# Altium project Mini_CS.PrjPcb
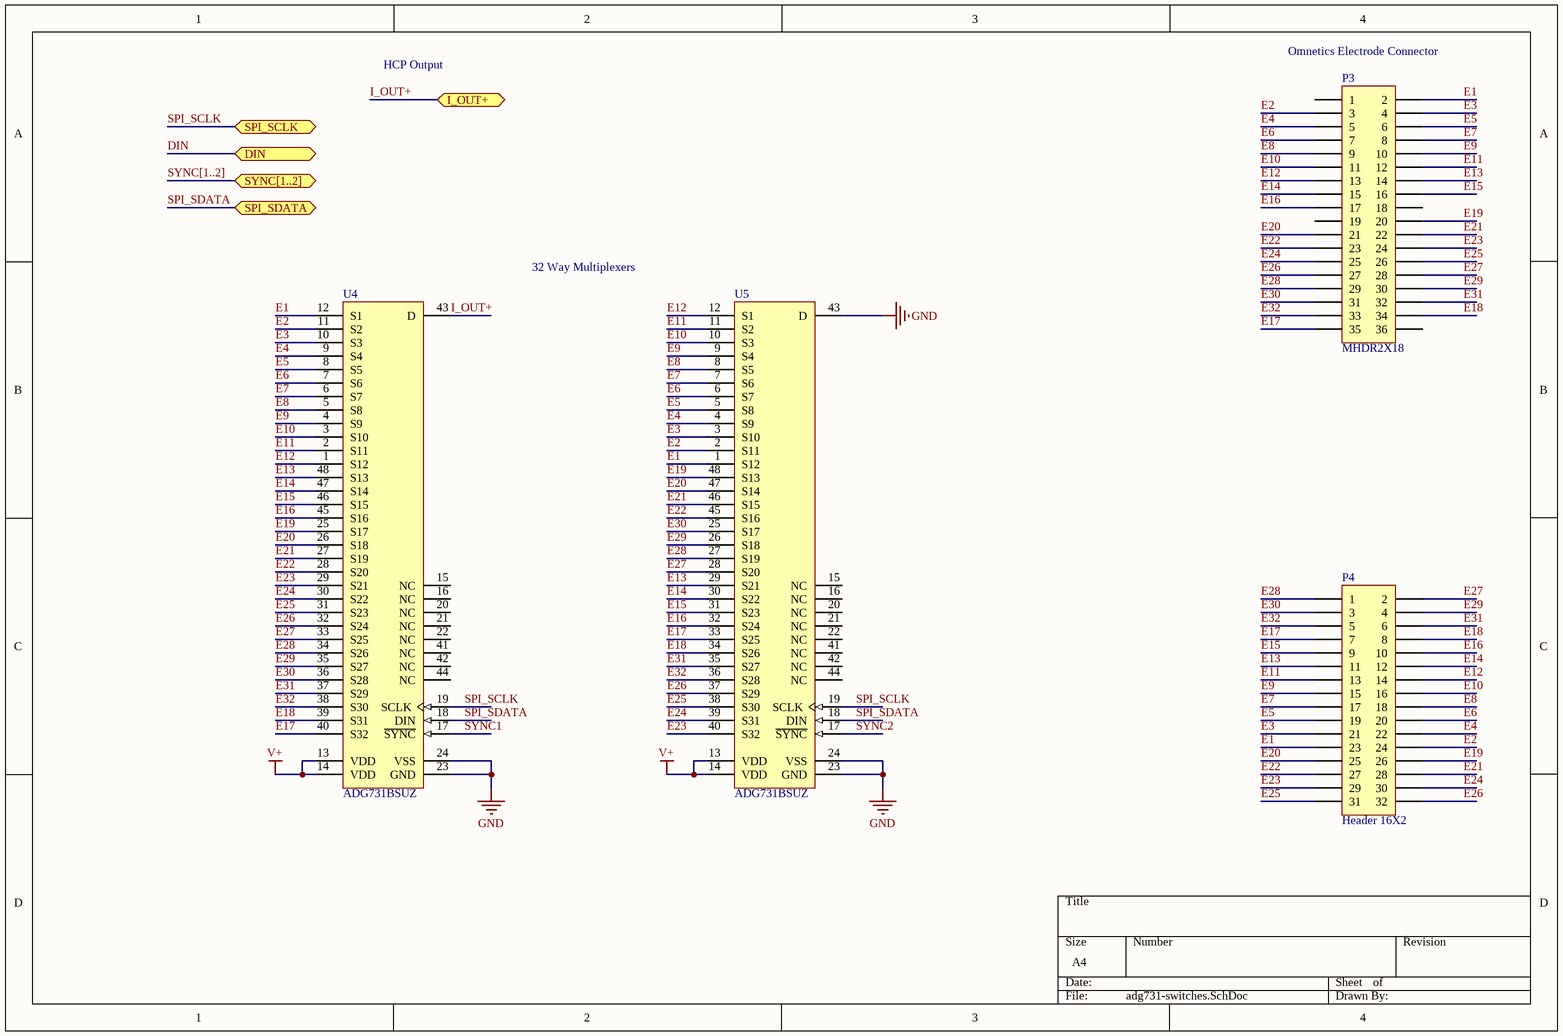
[diagram p0: adg731-switches.SchDoc]
3 sheets, 50 parts. Net scope: flat (ports and power ports of the same name join across sheets).
Board file: Mini_CS.PcbDoc
Sheets:
  adg731-switches.SchDoc
  AD9833_Single_Ended.SchDoc
  Power_Supply_and_Buttons.SchDoc

## Sheet adg731-switches.SchDoc
size A4

### Parts
P3  MHDR2X18  [A79025-001]
P4  Header 16X2  [FTSH-117-XX-XXX-DH]
U4  ADG731BSUZ  [ADI-SU-48_N]
U5  ADG731BSUZ  [ADI-SU-48_N]

### Ports
DIN (bidir), I_OUT+ (bidir), SPI_SCLK (bidir), SPI_SDATA (bidir), SYNC[1..2] (bidir)

### Nets
GND: U4.23(GND) U4.24(VSS) U5.23(GND) U5.24(VSS) U5.43(D)
V+: U4.13(VDD) U4.14(VDD) U5.13(VDD) U5.14(VDD)
DIN: port DIN
E1: P3.2 P4.23 U4.12(S1) U5.1(S12)
E2: P3.3 P4.24 U4.11(S2) U5.2(S11)
E3: P3.4 P4.21 U4.10(S3) U5.3(S10)
E4: P3.5 P4.22 U4.9(S4) U5.4(S9)
E5: P3.6 P4.19 U4.8(S5) U5.5(S8)
E6: P3.7 P4.20 U4.7(S6) U5.6(S7)
E7: P3.8 P4.17 U4.6(S7) U5.7(S6)
E8: P3.9 P4.18 U4.5(S8) U5.8(S5)
E9: P3.10 P4.15 U4.4(S9) U5.9(S4)
E10: P3.11 P4.16 U4.3(S10) U5.10(S3)
E11: P3.12 P4.13 U4.2(S11) U5.11(S2)
E12: P3.13 P4.14 U4.1(S12) U5.12(S1)
E13: P3.14 P4.11 U4.48(S13) U5.29(S21)
E14: P3.15 P4.12 U4.47(S14) U5.30(S22)
E15: P3.16 P4.9 U4.46(S15) U5.31(S23)
E16: P3.17 P4.10 U4.45(S16) U5.32(S24)
E17: P3.35 P4.7 U4.40(S32) U5.33(S25)
E18: P3.34 P4.8 U4.39(S31) U5.34(S26)
E19: P3.20 P4.26 U4.25(S17) U5.48(S13)
E20: P3.21 P4.25 U4.26(S18) U5.47(S14)
E21: P3.22 P4.28 U4.27(S19) U5.46(S15)
E22: P3.23 P4.27 U4.28(S20) U5.45(S16)
E23: P3.24 P4.29 U4.29(S21) U5.40(S32)
E24: P3.25 P4.30 U4.30(S22) U5.39(S31)
E25: P3.26 P4.31 U4.31(S23) U5.38(S30)
E26: P3.27 P4.32 U4.32(S24) U5.37(S29)
E27: P3.28 P4.2 U4.33(S25) U5.28(S20)
E28: P3.29 P4.1 U4.34(S26) U5.27(S19)
E29: P3.30 P4.4 U4.35(S27) U5.26(S18)
E30: P3.31 P4.3 U4.36(S28) U5.25(S17)
E31: P3.32 P4.6 U4.37(S29) U5.35(S27)
E32: P3.33 P4.5 U4.38(S30) U5.36(S28)
I_OUT+: U4.43(D) ; port I_OUT+
SPI_SCLK: U4.19(SCLK) U5.19(SCLK) ; port SPI_SCLK
SPI_SDATA: U4.18(DIN) U5.18(DIN) ; port SPI_SDATA
SYNC1: U4.17(~{SYNC})
SYNC2: U5.17(~{SYNC})

Not connected (* = marked no-connect by the designer): P3 1 18 19 36; U4 15(NC) 16(NC) 20(NC) 21(NC) 22(NC) 41(NC) 42(NC) 44(NC); U5 15(NC) 16(NC) 20(NC) 21(NC) 22(NC) 41(NC) 42(NC) 44(NC)

### Buses and harness runs
bus SYNC[1..2] = port SYNC[1..2]

### Notes on the sheet
- HCP Output
- (near P3) Omnetics Electrode Connector
- 32 Way Multiplexers

### Library data of the parts
P3 = MHDR2X18: Header, 18-Pin, Dual row; LatestRevisionDate: 17-Jul-2002; LatestRevisionNote: Re-released for DXP Platform.; Publisher: Altium Limited
P4 = Header 16X2: Header, 16-Pin, Dual row; LatestRevisionDate: 17-Jul-2002; LatestRevisionNote: Re-released for DXP Platform.; Publisher: Altium Limited
U4 U5 = CMP-0798-00240-1: 1.8 to 5.5 V / +/-2.5 V, 4 Ohm, Serially Controlled, 32-Channel Analog Multiplexer, -40 to 85 degC, 48-pin QFP (SU-48), Tray; Manufacturer: Analog Devices; Bandwidth (Hz): 18M; Max Analog Signal Range: Vss to Vdd; t transition (s): 42n; Ron (ohms): 4; Supply V Guar Performance: Dual_(+/-2.5V), Single_(+3V), Single_(+5V); ComponentLink2Description: Datasheet; Packing: Tray; Code_JEDEC: MS-026ABC; ComponentLink3URL: http://www.analog.com/static/imported-files/packages/470644706845302410119987SU48_7x7.pdf; PackageDescription: 48-Pin Thin Plastic Quad Flat Package, Body 7 x 7 mm, Pitch 0.5 mm; ComponentLink1Description: Manufacturer URL; DatasheetVersion: Rev. A; ComponentLink1URL: http://www.analog.com/en/index.html; Mounting Technology: Surface Mount; ComponentLink2URL: http://www.analog.com/static/imported-files/data_sheets/ADG725_731.pdf; PartNumber: ADG731BSUZ; PackageReference: SU-48; ComponentLink3Description: Package Specification

## Sheet AD9833_Single_Ended.SchDoc
size A4
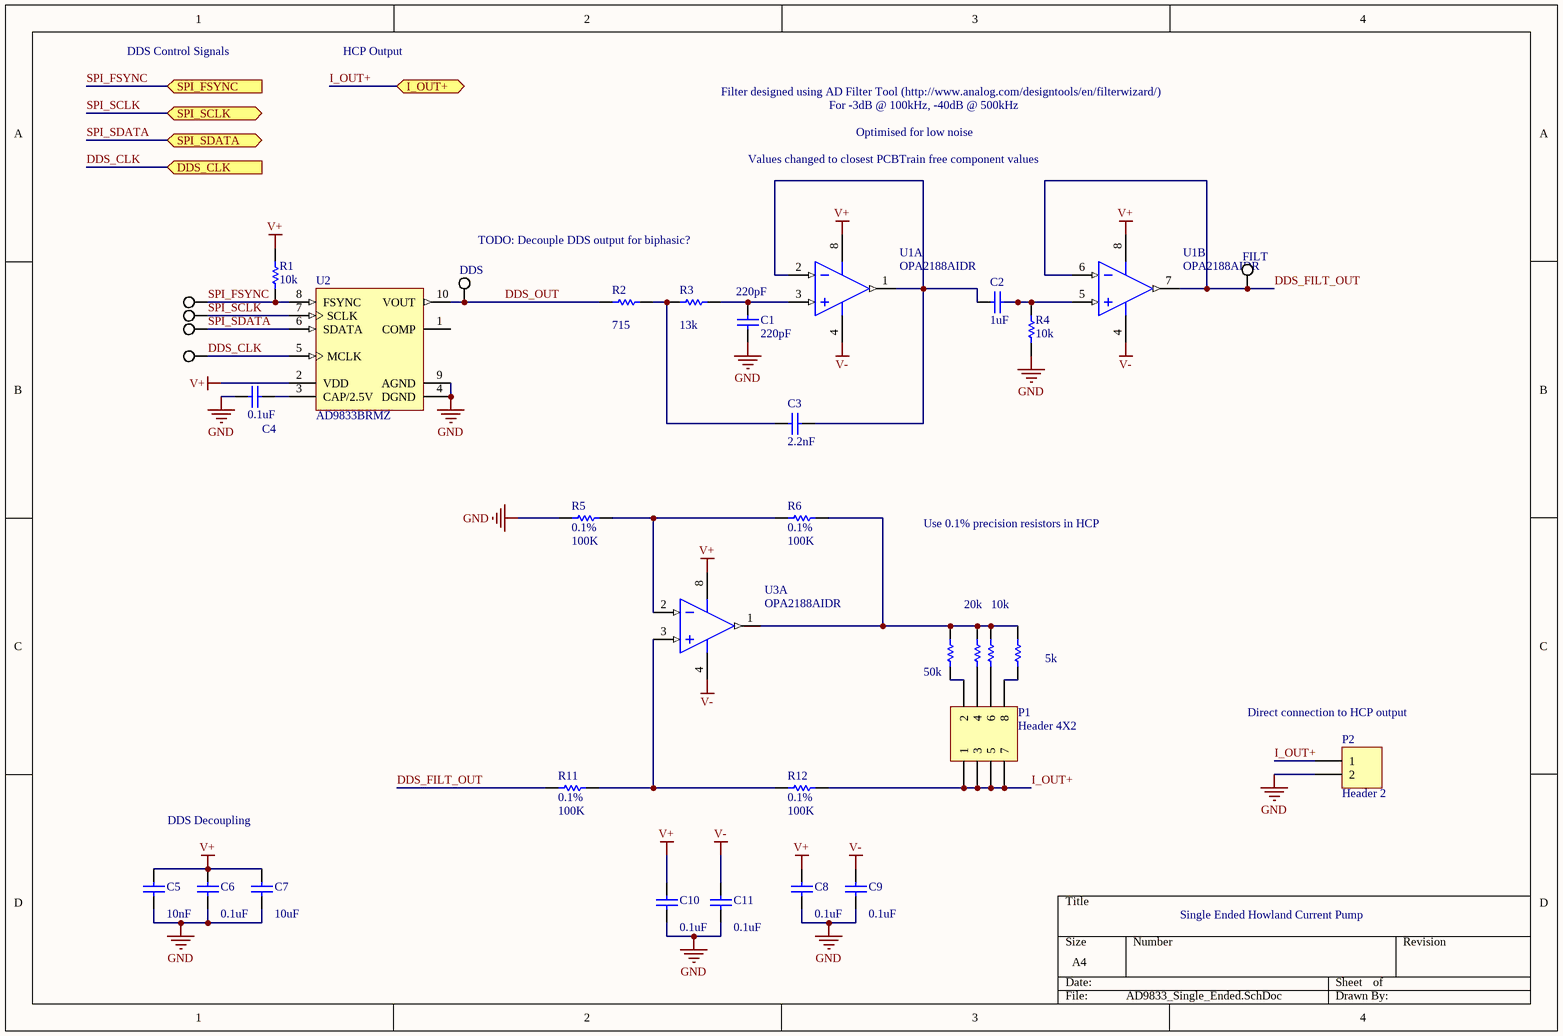
[diagram p1: AD9833_Single_Ended.SchDoc]

### Parts
C1  220pF  [1608[0603]]
C2  1uF  [1608[0603]]
C3  2.2nF  [1608[0603]]
C4  0.1uF  [1608[0603]]
C5  10nF  [1608[0603]]
C6  0.1uF  [1608[0603]]
C7  10uF  [1608[0603]]
C8  0.1uF  [1608[0603]]
C9  0.1uF  [1608[0603]]
C10  0.1uF  [1608[0603]]
C11  0.1uF  [1608[0603]]
CLK  TESTPOINT_WHITE  [TestPointVia]  (value not drawn)
DDS  TESTPOINT_WHITE  [TestPointVia]  (value not drawn)
FILT  TESTPOINT_WHITE  [TestPointVia]  (value not drawn)
FSYNC  TESTPOINT_WHITE  [TestPointVia]  (value not drawn)
P1  Header 4X2  [HDR2X4]
P2  Header 2  [HDR1X2]
R1  10k  [6-0805_M]
R2  715  [6-0805_M]
R3  13k  [6-0805_M]
R4  10k  [6-0805_M]
R5  0.1%  value 100K  [6-0805_M]
R6  0.1%  value 100K  [6-0805_M]
R7  50k  [6-0805_M]
R8  20k  [6-0805_M]
R9  10k  [6-0805_M]
R10  5k  [6-0805_M]
R11  0.1%  value 100K  [6-0805_M]
R12  0.1%  value 100K  [6-0805_M]
SCLK  TESTPOINT_WHITE  [TestPointVia]  (value not drawn)
SDAT  TESTPOINT_WHITE  [TestPointVia]  (value not drawn)
U1  OPA2188AIDR  [D0008A_L]  (parts A,B of 2)
U2  AD9833BRMZ  [ADI-RM-10_M]
U3  OPA2188AIDR  [D0008A_L]  (part A of 2)

### Ports
DDS_CLK (in), I_OUT+ (bidir), SPI_FSYNC (in), SPI_SCLK (bidir), SPI_SDATA (bidir)

### Nets
GND: C1.1 C4.1 C5.1 C6.1 C7.1 C8.1 C9.1 C10.1 C11.1 P2.2 R4.1 R5.1 U2.4(DGND) U2.9(AGND)
V+: C5.2 C6.2 C7.2 C8.2 C10.2 R1.2 U1.8(V+) U2.2(VDD) U3.8(V+)
V-: C9.2 C11.2 U1.4(V-) U3.4(V-)
DDS_CLK: CLK.1 U2.5(MCLK) ; port DDS_CLK
DDS_FILT_OUT: FILT.1 R11.1 U1.6(IN_B-) U1.7(OUT_B)
DDS_OUT: DDS.1 R2.1 U2.10(VOUT)
I_OUT+: P1.1 P1.3 P1.5 P1.7 P2.1 R12.2 ; port I_OUT+
SPI_FSYNC: FSYNC.1 R1.1 U2.8(FSYNC) ; port SPI_FSYNC
SPI_SCLK: SCLK.1 U2.7(SCLK) ; port SPI_SCLK
SPI_SDATA: SDAT.1 U2.6(SDATA) ; port SPI_SDATA
NetC1_2: C1.2 R3.2 U1.3(IN_A+)
NetC2_1: C2.1 C3.1 U1.1(OUT_A) U1.2(IN_A-)
NetC2_2: C2.2 R4.2 U1.5(IN_B+)
NetC3_2: C3.2 R2.2 R3.1
NetC4_2: C4.2 U2.3(CAP/2.5V)
NetP1_2: P1.2 R7.1
NetP1_4: P1.4 R8.2
NetP1_6: P1.6 R9.2
NetP1_8: P1.8 R10.2
NetR5_2: R5.2 R6.1 U3.2(IN_A-)
NetR6_2: R6.2 R7.2 R8.1 R9.1 R10.1 U3.1(OUT_A)
NetR11_2: R11.2 R12.1 U3.3(IN_A+)

Not connected (* = marked no-connect by the designer): U2 1(COMP)

### Notes on the sheet
- DDS Control Signals
- HCP Output
- Filter designed using AD Filter Tool (http://www.analog.com/designtools/en/filterwizard/)
- For -3dB @ 100kHz, -40dB @ 500kHz
- Values changed to closest PCBTrain free component values
- Optimised for low noise
- TODO: Decouple DDS output for biphasic?
- Use 0.1% precision resistors in HCP
- (near P2) Direct connection to HCP output
- DDS Decoupling
- Single Ended Howland Current Pump

### Library data of the parts
C1-C11 = Cap Semi: Capacitor (Semiconductor SIM Model); Published: 8-Jun-2000; LatestRevisionDate: 29-May-2009; LatestRevisionNote: IPC-7351 Footprint Added.; PackageReference: C1206; Publisher: Altium Limited; PackageDescription: Chip Capacitor
  C1: Value: 220pF
  C2: Value: 1uF
  C3: Value: 2.2nF
  C4 C6 C8-C11: Value: 0.1uF
  C5: Value: 10nF
  C7: Value: 10uF
P1 = Header 4X2: Header, 4-Pin, Dual row; LatestRevisionDate: 17-Jul-2002; LatestRevisionNote: Re-released for DXP Platform.; Publisher: Altium Limited
P2 = Header 2: Header, 2-Pin; LatestRevisionDate: 17-Jul-2002; LatestRevisionNote: Re-released for DXP Platform.; Publisher: Altium Limited
R1-R12 = Res1: Resistor; Published: 8-Jun-2000; LatestRevisionDate: 17-Jul-2002; LatestRevisionNote: Re-released for DXP Platform.; PackageReference: AXIAL-0.3; Publisher: Altium Limited; PackageDescription: Axial Device, Thru-Hole; 2 Leads; 0.3 in Pin Spacing
  R1 R4 R9: Value: 10k
  R2: Value: 715
  R3: Value: 13k
  R7: Value: 50k
  R8: Value: 20k
  R10: Value: 5k
U1 U3 = CMP-0272-00241-3: 0.03 uV/degC, 6 uV Vos, Low Noise, Rail-to-Rail Output, Zero-Drift Operational Amplifier, 4 to 36 V, -40 to 105 degC, 8-pin SOIC (D8), Green (RoHS & no Sb/Br); Manufacturer: Texas Instruments; Rating: Catalog; Number of Channels: 2; CMRR(Min)(dB): 120; Total Supply Voltage(Max)(+5V is 5, +/-5V is 10): 36; Packing: LARGE T&R; Slew Rate(Typ)(V/us): 0.8; Iq per channel(Max)(mA): 0.475; Vio (25C)(Max)(mV): 0.025; IIB(Max)(pA): 850; Offset Drift(Typ)(uV/C): 0.03; Sub Family: High Supply Voltage Amplifier (>=30V), Low Noise Amp (<=10nV/rtHz), Low Offset Voltage Amplifier (<=500uV), Low Power Amp (<=500uA), Precision Amplifier, Zero Drift Precision Amplifier; Total Supply Voltage(Min)(+5V is 5, +/-5V is 10): 4; Mounting Technology: Surface Mount; Code_JEDEC: MS-012; ComponentLink2Description: Datasheet; DatasheetVersion: SBOS525B; ComponentLink1URL: http://www.ti.com/; GBW(Typ)(MHz): 2; Eco-Plan: Green (RoHS & no Sb/Br); PackageVersion: 4040047-3/M, 06/2011; ComponentLink3Description: Package Specification; ComponentLink1Description: Manufacturer URL; PartNumber: OPA2188AIDR; ComponentLink2URL: http://www.ti.com/lit/ds/symlink/opa2188.pdf; ComponentLink3URL: http://www.ti.com/litv/pdf/msoi002j; PackageReference: D0008A; PackageDescription: 8-Pin Plastic Small Outline, Body 4.9 x 3.9 mm, Pitch 1.27 mm; PartId: 1
U2 = CMP-0293-00077-1: Low Power, 12.65 mW, 2.3 V to 5.5 V, Programmable Waveform Generator, 10-Bit, Serial, RM-10, 50 Tube, Pb-Free; Resolution (Bits): 10bit; Compliance Range (V): 650mV; FS Iout (mA nom): 3mA; REFCLK Multiplier: No; Master fclk: 25MHz; I Supply total (max): 5.5mA; Tuning Word Width (bits): 28bit; Code_JEDEC: MO-187-BA; DatasheetVersion: Rev. D; PackageVersion: 5/8/2005; ComponentLink1URL: www.analog.com; ComponentLink3Description: Package Specification; PackageDescription: 10-Lead Mini Small Outline Package [MSOP]; I/O Interface: Serial; ComponentLink2Description: Datasheet; ComponentLink1Description: Manufacturer URL; PackageReference: RM-10; ComponentLink2URL: http://www.analog.com/static/imported-files/data_sheets/AD9833.pdf; ComponentLink3URL: http://www.analog.com/static/imported-files/packages/PKG_PDF/MSOP%28RM%29/RM_10.pdf

## Sheet Power_Supply_and_Buttons.SchDoc
size A4
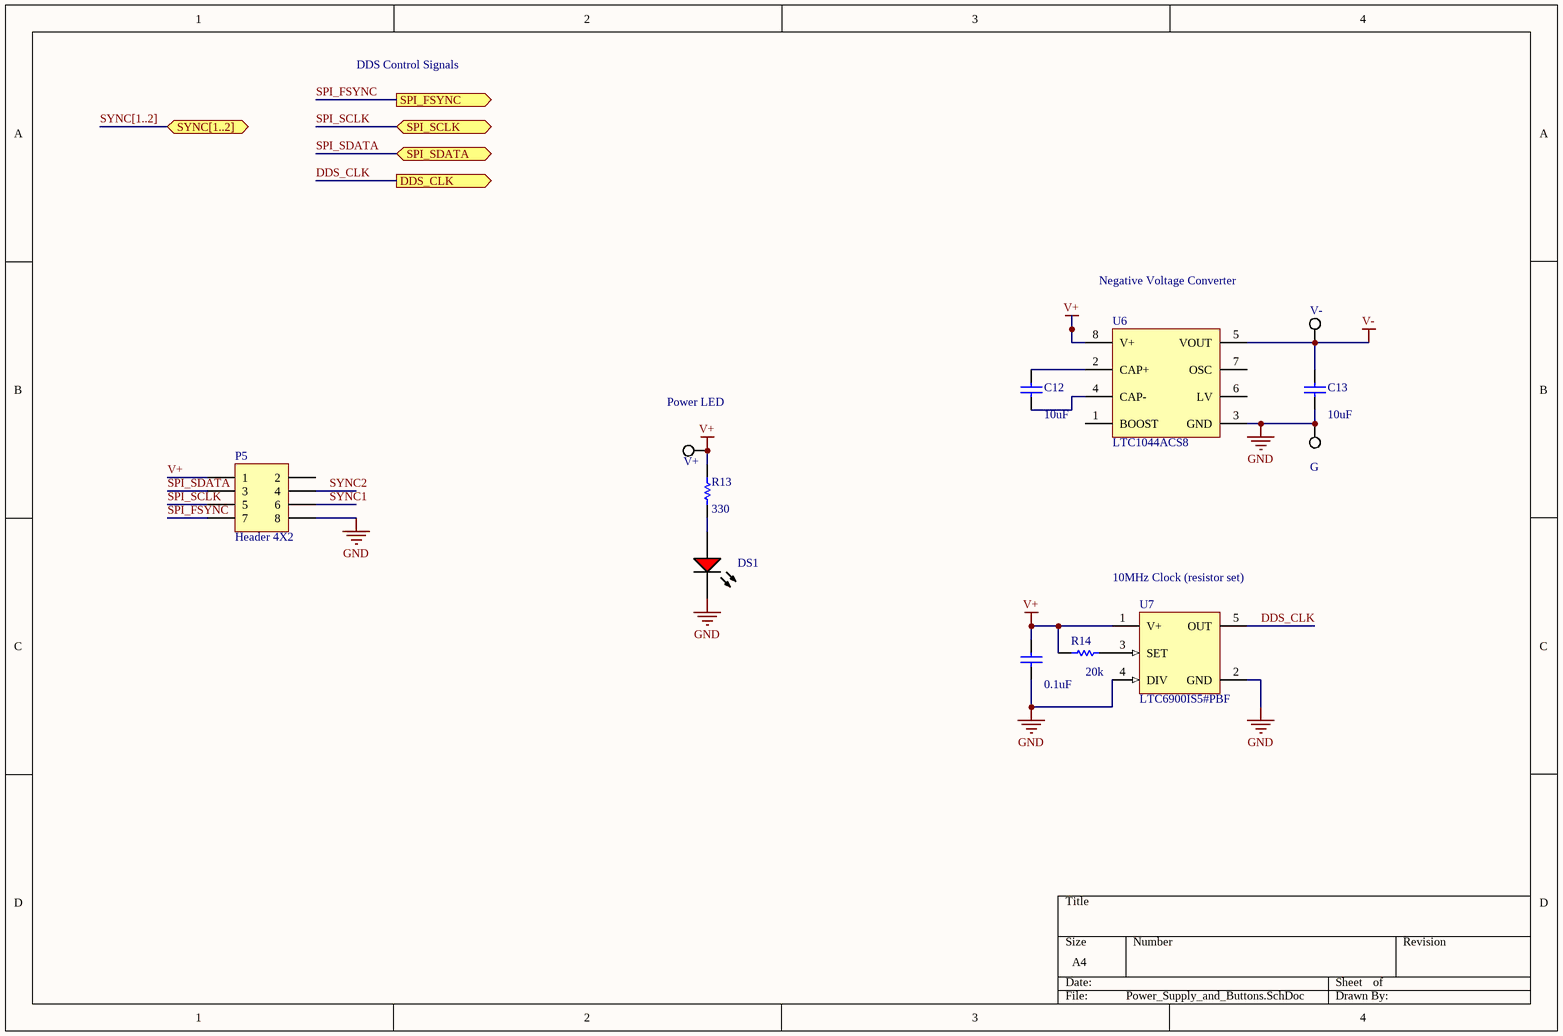
[diagram p2: Power_Supply_and_Buttons.SchDoc]

### Parts
C12  10uF  [1608[0603]]
C13  10uF  [1608[0603]]
C14  0.1uF  [1608[0603]]
DS1  TLMS1100-GS08  [VISH-TLMX1100_V]  (value not drawn)
G  TESTPOINT_WHITE  [TestPointVia]  (value not drawn)
P5  Header 4X2  [HDR2X4]
R13  330  [6-0805_M]
R14  20k  [6-0805_M]
U6  LTC1044ACS8  [LT-S8-8_M]
U7  LTC6900IS5#PBF  [LT-TSOT-23-5_V]
V+  TESTPOINT_WHITE  [TestPointVia]  (value not drawn)
V-  TESTPOINT_WHITE  [TestPointVia]  (value not drawn)

### Ports
DDS_CLK (out), SPI_FSYNC (out), SPI_SCLK (bidir), SPI_SDATA (bidir), SYNC[1..2] (bidir)

### Nets
GND: C13.1 C14.1 DS1.2(K) G.1 P5.8 U6.3(GND) U7.2(GND) U7.4(DIV)
V+: C14.2 P5.1 R13.2 R14.1 U6.8(V+) U7.1(V+) V+.1
V-: C13.2 U6.5(VOUT) V-.1
DDS_CLK: U7.5(OUT) ; port DDS_CLK
SPI_FSYNC: P5.7 ; port SPI_FSYNC
SPI_SCLK: P5.5 ; port SPI_SCLK
SPI_SDATA: P5.3 ; port SPI_SDATA
SYNC1: P5.6
SYNC2: P5.4
NetC12_1: C12.1 U6.4(CAP-)
NetC12_2: C12.2 U6.2(CAP+)
NetDS1_1: DS1.1(A) R13.1
NetR14_2: R14.2 U7.3(SET)

Not connected (* = marked no-connect by the designer): P5 2; U6 1(BOOST) 6(LV) 7(OSC)

### Buses and harness runs
bus SYNC[1..2] = port SYNC[1..2]

### Notes on the sheet
- DDS Control Signals
- Negative Voltage Converter
- (near V+) Power LED
- (near U7) 10MHz Clock (resistor set)

### Library data of the parts
C12-C14 = Cap Semi: Capacitor (Semiconductor SIM Model); Published: 8-Jun-2000; LatestRevisionDate: 29-May-2009; LatestRevisionNote: IPC-7351 Footprint Added.; PackageReference: C1206; Publisher: Altium Limited; PackageDescription: Chip Capacitor
  C12 C13: Value: 10uF
  C14: Value: 0.1uF
DS1 = CMP-1666-00027-1: LED, RED, 2.1 V, -40 to 100 degC, 2-Pin SMD (0603), RoHS, Tape and Reel; Type (Capacitors): C0G; Resistance: 100000000000 Ohm; Capacitance: 12 pF; Voltage Rating: 50 V; Tolerance: 5%; Min Operating Temperature: -55degC; REACH SVHC: No SVHC; ComponentLink2Description: Datasheet; ComponentLink1URL: http://www.vishay.com/; Width: 0.8 mm; Package Quantity: 4000; PackageReference: TLMX1100; ComponentLink2URL: http://www.vishay.com/docs/83173/tlmb1100.pdf; Case/Package: 0603; Case Code (Metric): 1608; Packaging: Tape and Reel; Pins: 2; ComponentLink1Description: Manufacturer URL; Max Operating Temperature: 125degC; Height: 0.8 mm; Length: 1.6 mm; Mount: Surface Mount; PackageDescription: 2-Pin Surface Mount Device, Body 1.6 x 0.8 mm; DatasheetVersion: Rev. 2.7, 03/2016; Case Code (Imperial): 0603; Voltage Rating (DC): 50 V; RoHSCompliant: True; Radiation Hardening: No
P5 = Header 4X2: Header, 4-Pin, Dual row; LatestRevisionDate: 17-Jul-2002; LatestRevisionNote: Re-released for DXP Platform.; Publisher: Altium Limited
R13 R14 = Res1: Resistor; Published: 8-Jun-2000; LatestRevisionDate: 17-Jul-2002; LatestRevisionNote: Re-released for DXP Platform.; PackageReference: AXIAL-0.3; Publisher: Altium Limited; PackageDescription: Axial Device, Thru-Hole; 2 Leads; 0.3 in Pin Spacing
  R13: Value: 330
  R14: Value: 20k
U6 = CMP-0475-00491-1: 12 V CMOS Voltage Converter, 8-pin SOIC (S8-8), 0 to 70 degC; Manufacturer: Linear Technology; Isupply(mA): 0.2; Voutput: 2Vin, -Vin, 0.5Vin; Vin Max(V): 12; Frequency(kHz): 5; Max Iout(mA): 20; Vin Min(V): 1.5; ComponentLink1Description: Manufacturer URL; PartNumber: LTC1044ACS8; PackageVersion: Rev. G, 03/2012; ComponentLink2URL: http://cds.linear.com/docs/en/datasheet/lt1044a.pdf; PackageReference: S8-8; ComponentLink2Description: Datasheet; DatasheetVersion: Rev. 0; RoHS: FALSE; PackageDescription: 8-Pin Plastic Small Outline (Narrow .150 Inch), Body 4.9 x 3.9 mm, Pitch 1.27 mm; ComponentLink3Description: Package Specification; Mounting Technology: Surface Mount; ComponentLink3URL: http://cds.linear.com/docs/en/packaging/05081610_G_SO8.pdf; ComponentLink1URL: http://www.linear.com/
U7 = CMP-2000-06612-1: Low Power, Resistor Set Oscillator, 1 KHz to 20 MHz, 2.7 to 5.5 V, -40 to 85 degC, 5-Pin SOT-23 (S5), Pb-Free; Manufacturer: Linear Technology; Frequency: 20MHz; Supply Voltage Range: 2.7Vto5.5V; Supply Voltage Min: 2.7V; Supply Voltage Max: 5.5V; Base Number: 6900; SVHC: NoSVHC(19-Dec-2012); No. of Pins: 5; Clock External Input: No; Operating Temperature Min: -40°C; Operating Temperature Range: -40°Cto+85°C; Manufacturer URL: http://www.linear.com/; Operating Frequency Max: 20MHz; Package Description: 5-Pin Small Outline Transistor, Body 2.9 x 1.625 mm, Pitch 0.95 mm; Operating Temperature Max: 85°C; MSL: MSL1-Unlimited; Datasheet Version: Rev. A, 07/2009; Package / Case: SOT-23; Datasheet URL: http://cds.linear.com/docs/en/datasheet/6900fa.pdf; Termination Type: SMD; Package Reference: TSOT23-5; Mounting Technology: SurfaceMount; Digital IC Case Style: SOT-23

## Nets that join several sheets
GND: adg731-switches (5 pins), AD9833_Single_Ended (14 pins), Power_Supply_and_Buttons (8 pins)
V+: adg731-switches (U4.13 U4.14 U5.13 U5.14), AD9833_Single_Ended (9 pins), Power_Supply_and_Buttons (7 pins)
V-: AD9833_Single_Ended (C9.2 C11.2 U1.4 U3.4), Power_Supply_and_Buttons (C13.2 U6.5 V-.1)
DDS_CLK: AD9833_Single_Ended (CLK.1 U2.5), Power_Supply_and_Buttons (U7.5)
I_OUT+: adg731-switches (U4.43), AD9833_Single_Ended (6 pins)
SPI_FSYNC: AD9833_Single_Ended (FSYNC.1 R1.1 U2.8), Power_Supply_and_Buttons (P5.7)
SPI_SCLK: adg731-switches (U4.19 U5.19), AD9833_Single_Ended (SCLK.1 U2.7), Power_Supply_and_Buttons (P5.5)
SPI_SDATA: adg731-switches (U4.18 U5.18), AD9833_Single_Ended (SDAT.1 U2.6), Power_Supply_and_Buttons (P5.3)
SYNC1: adg731-switches (U4.17), Power_Supply_and_Buttons (P5.6)
SYNC2: adg731-switches (U5.17), Power_Supply_and_Buttons (P5.4)